# Altium schematic sheet buttons_and_io_connector.SchDoc
size 447 x 332 mm
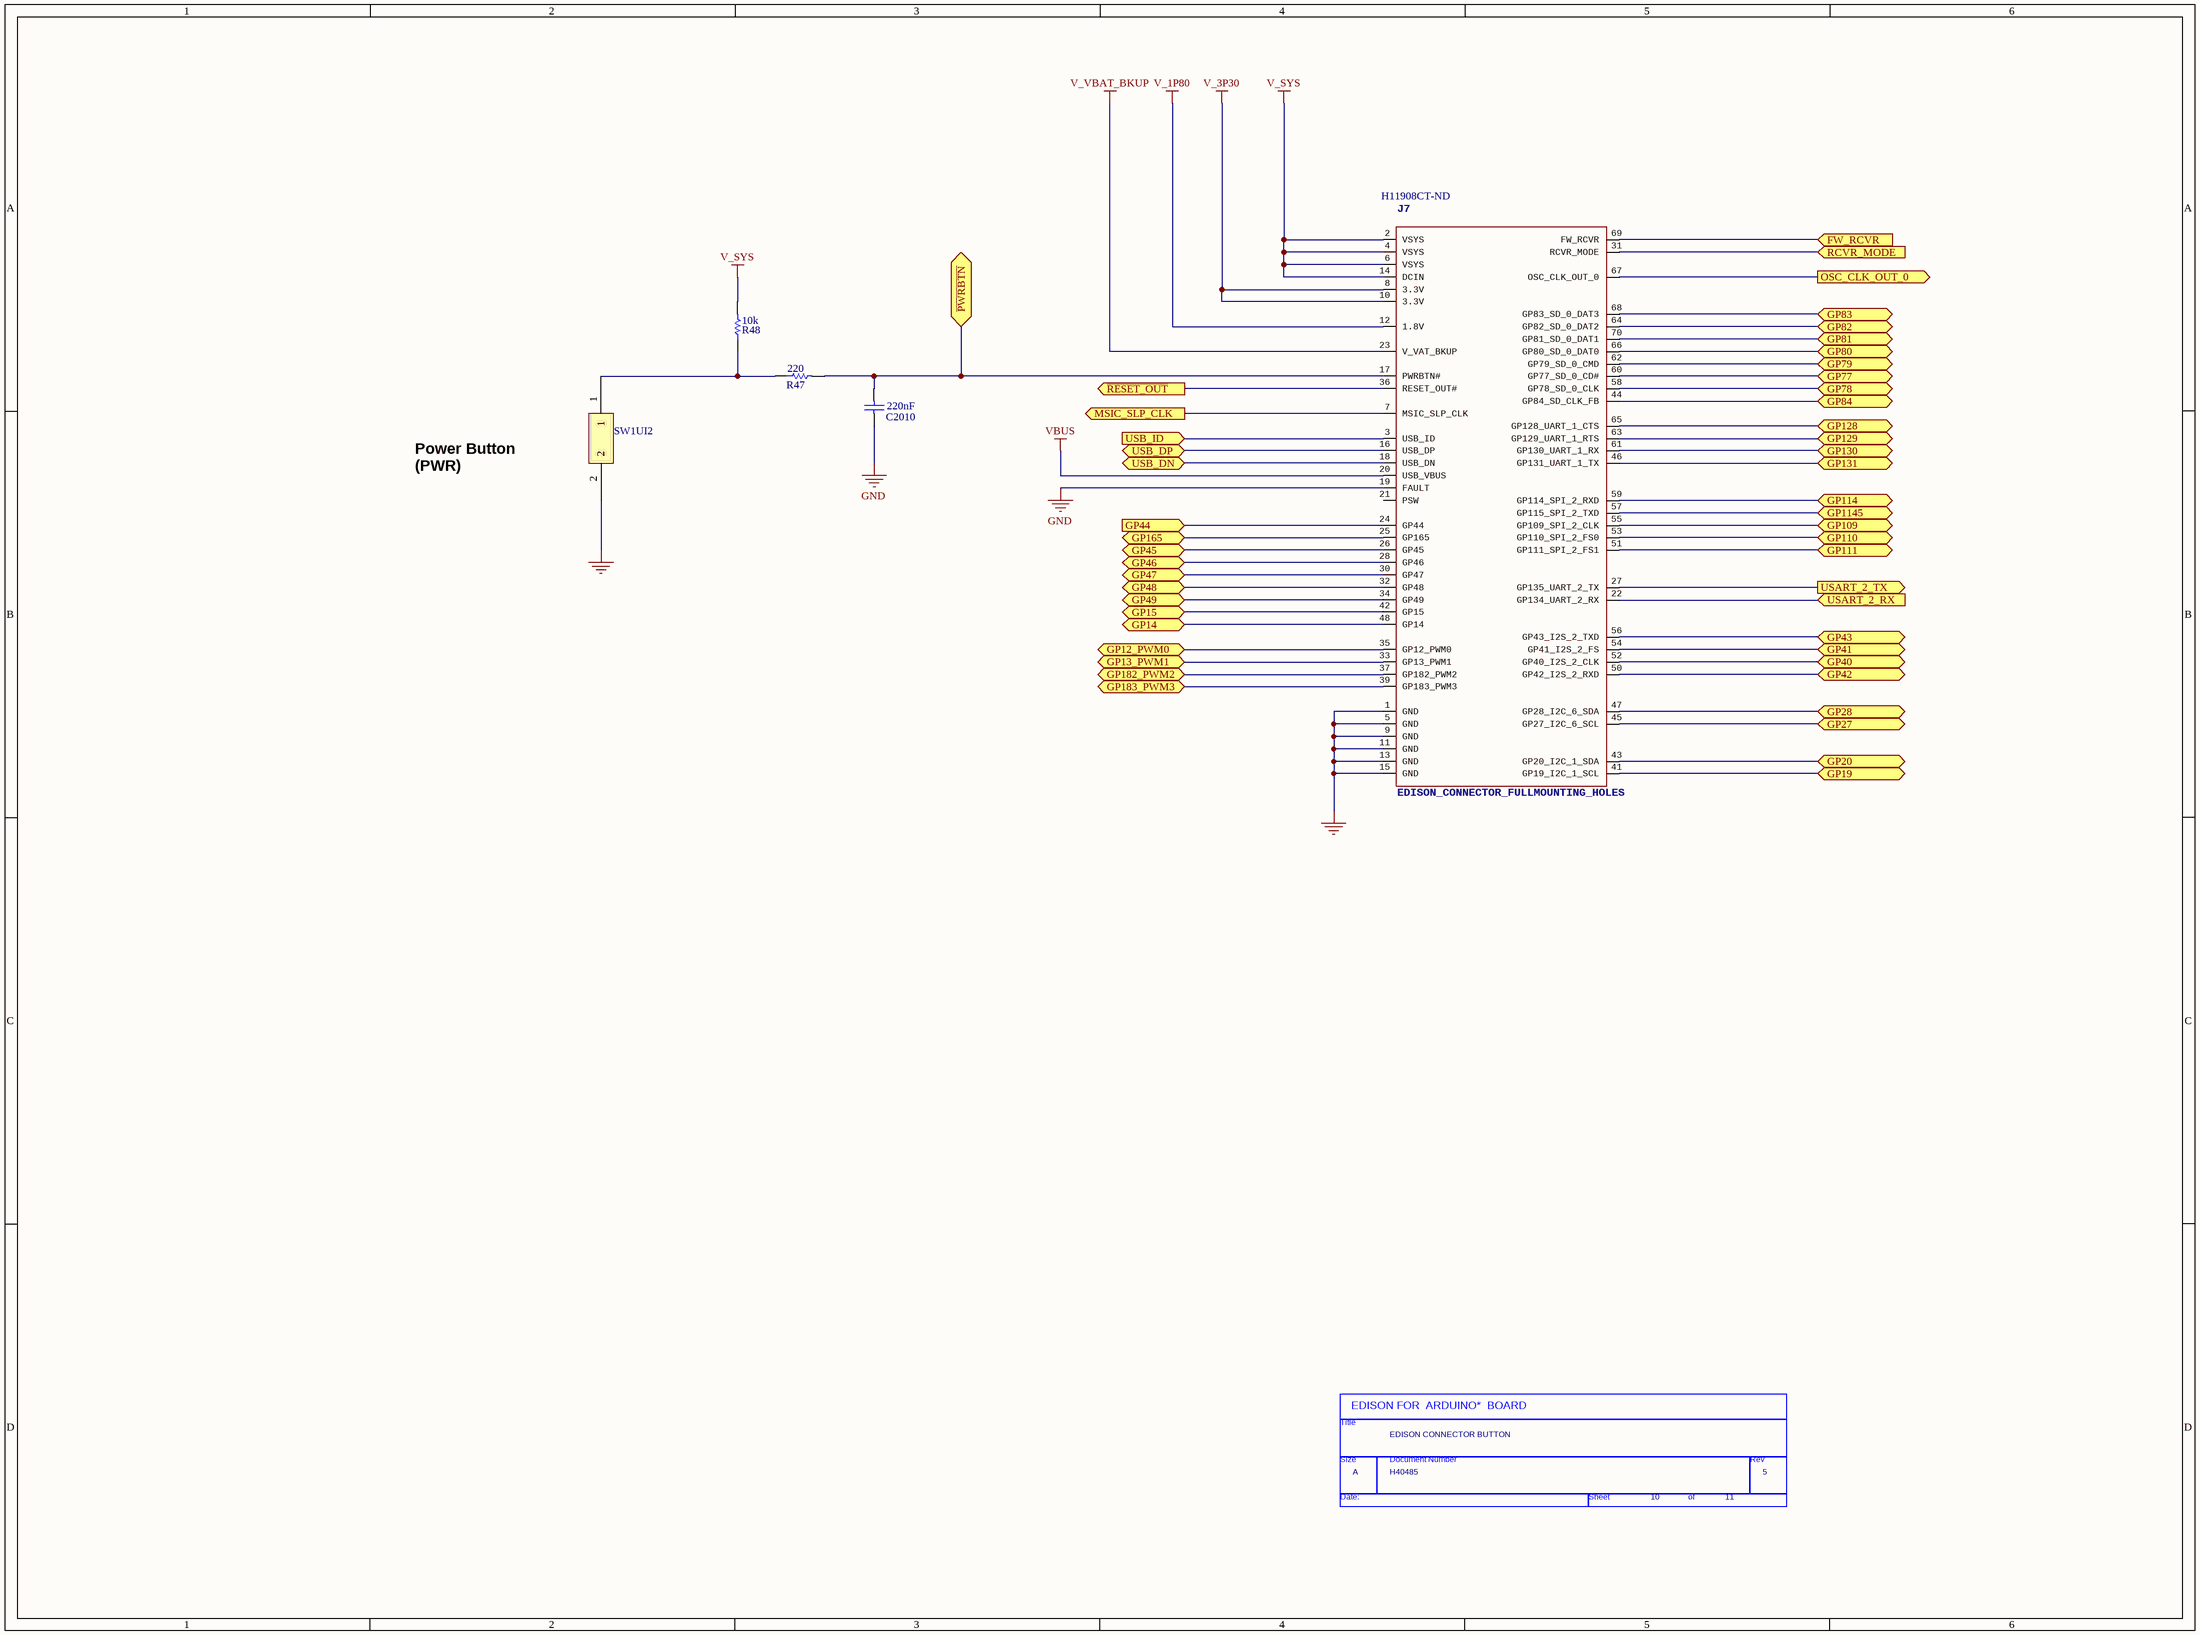
[diagram p0: buttons_and_io_connector.SchDoc]

## Parts
*  Page Count: 11  Page Number: 10  Page Size: A  Title: EDISON CONNECTOR BUTTON  RevCode: 5  Doc: H40485  (hidden comment: TitleBlock0)  (graphical)
C2010  value 220nF  [CAPC0805(2012)145_M]  (hidden comment: CAP 220nF 16V 0805(2012))
J7  EDISON_CONNECTOR_FULLMOUNTING_HOLES  Supplier Part Number 1: H11908CT-ND  [EDISON_DAUGHTER]
R47  value 220  [RESC0805(2012)_M]  (hidden comment: 220R 1% 0805(2012))
R48  value 10k  [RESC0805(2012)_M]  (hidden comment: 10K 1% 0805(2012))
SW1UI2  Tl1015AF160QG  [TL1015AF160QG]  (value not drawn)

## Ports
FW_RCVR (in), GP12_PWM0 (bidir), GP13_PWM1 (bidir), GP14 (bidir), GP15 (bidir), GP19 (bidir), GP20 (bidir), GP27 (bidir), GP28 (bidir), GP40 (bidir), GP41 (bidir), GP42 (bidir), GP43 (bidir), GP44 (in), GP45 (bidir), GP46 (bidir), GP47 (bidir), GP48 (bidir), GP49 (bidir), GP77 (bidir), GP78 (bidir), GP79 (bidir), GP80 (bidir), GP81 (bidir), GP82 (bidir), GP83 (bidir), GP84 (bidir), GP109 (bidir), GP110 (bidir), GP111 (bidir), GP114 (bidir), GP128 (bidir), GP129 (bidir), GP130 (bidir), GP131 (bidir), GP165 (bidir), GP182_PWM2 (bidir), GP183_PWM3 (bidir), GP1145 (bidir), MSIC_SLP_CLK (out), OSC_CLK_OUT_0 (out), RCVR_MODE (in), USART_2_RX (in), USART_2_TX (out), USB_DN (bidir), USB_DP (bidir), USB_ID (in), ~{PWRBTN} (bidir), ~{RESET_OUT} (out)

## Nets
GND: C2010.1 J7.1(GND) J7.5(GND) J7.9(GND) J7.11(GND) J7.13(GND) J7.15(GND) J7.19(FAULT) SW1UI2.2
V_1P80: J7.12(1.8V)
V_3P30: J7.8(3.3V) J7.10(3.3V)
V_SYS: J7.2(VSYS) J7.4(VSYS) J7.6(VSYS) J7.14(DCIN) R48.2
V_VBAT_BKUP: J7.23(V_VAT_BKUP)
VBUS: J7.20(USB_VBUS)
FW_RCVR: J7.69(FW_RCVR) ; port FW_RCVR
GP12_PWM0: J7.35(GP12_PWM0) ; port GP12_PWM0
GP13_PWM1: J7.33(GP13_PWM1) ; port GP13_PWM1
GP14: J7.48(GP14) ; port GP14
GP15: J7.42(GP15) ; port GP15
GP19: J7.41(GP19_I2C_1_SCL) ; port GP19
GP20: J7.43(GP20_I2C_1_SDA) ; port GP20
GP27: J7.45(GP27_I2C_6_SCL) ; port GP27
GP28: J7.47(GP28_I2C_6_SDA) ; port GP28
GP40: J7.52(GP40_I2S_2_CLK) ; port GP40
GP41: J7.54(GP41_I2S_2_FS) ; port GP41
GP42: J7.50(GP42_I2S_2_RXD) ; port GP42
GP43: J7.56(GP43_I2S_2_TXD) ; port GP43
GP44: J7.24(GP44) ; port GP44
GP45: J7.26(GP45) ; port GP45
GP46: J7.28(GP46) ; port GP46
GP47: J7.30(GP47) ; port GP47
GP48: J7.32(GP48) ; port GP48
GP49: J7.34(GP49) ; port GP49
GP77: J7.60(GP77_SD_0_CD#) ; port GP77
GP78: J7.58(GP78_SD_0_CLK) ; port GP78
GP79: J7.62(GP79_SD_0_CMD) ; port GP79
GP80: J7.66(GP80_SD_0_DAT0) ; port GP80
GP81: J7.70(GP81_SD_0_DAT1) ; port GP81
GP82: J7.64(GP82_SD_0_DAT2) ; port GP82
GP83: J7.68(GP83_SD_0_DAT3) ; port GP83
GP84: J7.44(GP84_SD_CLK_FB) ; port GP84
GP109: J7.55(GP109_SPI_2_CLK) ; port GP109
GP110: J7.53(GP110_SPI_2_FS0) ; port GP110
GP111: J7.51(GP111_SPI_2_FS1) ; port GP111
GP114: J7.59(GP114_SPI_2_RXD) ; port GP114
GP128: J7.65(GP128_UART_1_CTS) ; port GP128
GP129: J7.63(GP129_UART_1_RTS) ; port GP129
GP130: J7.61(GP130_UART_1_RX) ; port GP130
GP131: J7.46(GP131_UART_1_TX) ; port GP131
GP165: J7.25(GP165) ; port GP165
GP182_PWM2: J7.37(GP182_PWM2) ; port GP182_PWM2
GP183_PWM3: J7.39(GP183_PWM3) ; port GP183_PWM3
GP1145: J7.57(GP115_SPI_2_TXD) ; port GP1145
MSIC_SLP_CLK: J7.7(MSIC_SLP_CLK) ; port MSIC_SLP_CLK
OSC_CLK_OUT_0: J7.67(OSC_CLK_OUT_0) ; port OSC_CLK_OUT_0
~{PWRBTN}: C2010.2 J7.17(PWRBTN#) R47.2 ; port ~{PWRBTN}
~{RESET_OUT}: J7.36(RESET_OUT#) ; port ~{RESET_OUT}
RCVR_MODE: J7.31(RCVR_MODE) ; port RCVR_MODE
USART_2_RX: J7.22(GP134_UART_2_RX) ; port USART_2_RX
USART_2_TX: J7.27(GP135_UART_2_TX) ; port USART_2_TX
USB_DN: J7.18(USB_DN) ; port USB_DN
USB_DP: J7.16(USB_DP) ; port USB_DP
USB_ID: J7.3(USB_ID) ; port USB_ID
NetR47_1: R47.1 R48.1 SW1UI2.1

Not connected (* = marked no-connect by the designer): J7 21(PSW)

## Notes on the sheet
- (near SW1UI2) Power Button
  (PWR)
- (in symbol TitleBlock0) EDISON FOR  ARDUINO*  BOARD; Title; Size; Document Number; Rev; Date:; Sheet; of

## Library data of the parts
C2010 = CMP-1036-04533-1: CAP 220nF 16V ±10% 0805 (2012 Metric) Thickness 1.45mm SMD; Case-EIA: 0805; Case-Metric: 2012; Tolerance: ±10%; Max Thickness: 1.45 mm; Technology: SMT; Rated Voltage: 16 V; Supplier 1: Digi-Key; Supplier Part Number 1: 1276-1284-1-ND
R47 = CMP-1013-00433-1: 220R 0.125W 1% 0805 (2012 Metric)  SMD; Case-EIA: 0805; Case-Metric: 2012; Technology: SMT; Tolerance: 1 %; Power: 0.125 W; Supplier 1: Digi-Key; Supplier Part Number 1: 311-220CRCT-ND
R48 = CMP-1013-00623-1: 10K 0.125W 1% 0805 (2012 Metric)  SMD; Case-Metric: 2012; Case-EIA: 0805; Tolerance: 1 %; Power: 0.125 W; Technology: SMT; Supplier 1: Digi-Key; Supplier Part Number 1: 311-10.0KCRCT-ND
* = TitleBlock0: Page Create Date: March  8, 1995
J7 = EDISON_CONNECTOR_FULLMOUNTING_HOLES: Supplier 1: Digi-Key
SW1UI2 = Tl1015AF160QG: Supplier 1: Digi-Key; Supplier Part Number 1: EG4344DKR-ND